# EAGLE design relay power board (EAGLE 6.3)
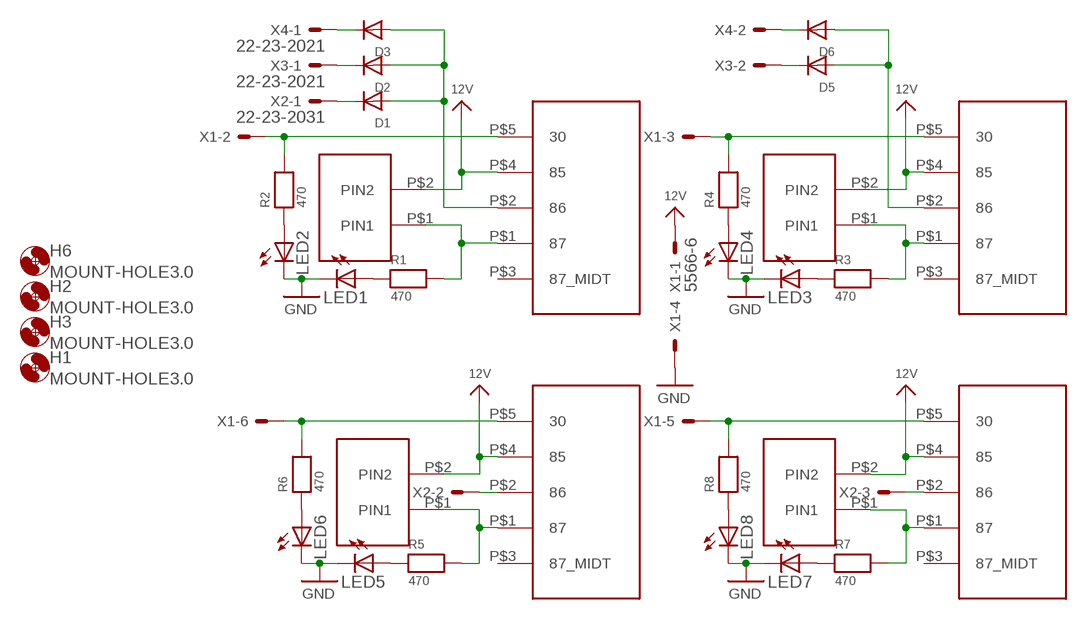
[diagram p0: schematic, sheet 1]

## Parts
D1  DIODESMA  [SMADIODE]
D2  DIODESMA  [SMADIODE]
D3  DIODESMA  [SMADIODE]
D5  DIODESMA  [SMADIODE]
D6  DIODESMA  [SMADIODE]
H1  MOUNT-HOLE3.0  [3,0]
H2  MOUNT-HOLE3.0  [3,0]
H3  MOUNT-HOLE3.0  [3,0]
H6  MOUNT-HOLE3.0  [3,0]
LED1  LEDCHIPLED_1206  [CHIPLED_1206]
LED2  LEDCHIPLED_1206  [CHIPLED_1206]
LED3  LEDCHIPLED_1206  [CHIPLED_1206]
LED4  LEDCHIPLED_1206  [CHIPLED_1206]
LED5  LEDCHIPLED_1206  [CHIPLED_1206]
LED6  LEDCHIPLED_1206  [CHIPLED_1206]
LED7  LEDCHIPLED_1206  [CHIPLED_1206]
LED8  LEDCHIPLED_1206  [CHIPLED_1206]
R1  470  RESISTOR_0603  [_0603]
R2  470  RESISTOR_0603  [_0603]
R3  470  RESISTOR_0603  [_0603]
R4  470  RESISTOR_0603  [_0603]
R5  470  RESISTOR_0603  [_0603]
R6  470  RESISTOR_0603  [_0603]
R7  470  RESISTOR_0603  [_0603]
R8  470  RESISTOR_0603  [_0603]
U$1  FUSE_SOCKET  [FUSE_SOCKET_12V_30A]
U$2  FUSE_SOCKET  [FUSE_SOCKET_12V_30A]
U$3  LITTE_FUSE  [LITTE_FUSE_PAC]
U$4  FUSE_SOCKET  [FUSE_SOCKET_12V_30A]
U$5  LITTE_FUSE  [LITTE_FUSE_PAC]
U$10  FUSE_SOCKET  [FUSE_SOCKET_12V_30A]
U$11  LITTE_FUSE  [LITTE_FUSE_PAC]
U$18  LITTE_FUSE  [LITTE_FUSE_PAC]
X1  5566-6  [5566-6]
X2  22-23-2031  [22-23-2031]
X3  22-23-2021  [22-23-2021]
X4  22-23-2021  [22-23-2021]

## Nets
12V: U$1.P$4 U$2.P$4 U$3.P$2(PIN2) U$4.P$4 U$5.P$2(PIN2) U$10.P$4 U$11.P$2(PIN2) U$18.P$2(PIN2) X1.1
GND: LED1.C LED2.C LED3.C LED4.C LED5.C LED6.C LED7.C LED8.C X1.4
N$1: R3.2 U$2.P$1 U$3.P$1(PIN1)
N$2: R1.2 U$1.P$1 U$5.P$1(PIN1)
N$3: D1.A D2.A D3.A U$1.P$2
N$4: LED1.A R1.1
N$5: LED2.A R2.1
N$6: R2.2 U$1.P$5 X1.2
N$7: D5.A D6.A U$2.P$2
N$8: LED3.A R3.1
N$9: LED4.A R4.1
N$10: R4.2 U$2.P$5 X1.3
N$11: R5.2 U$10.P$1 U$11.P$1(PIN1)
N$12: R7.2 U$4.P$1 U$18.P$1(PIN1)
N$13: LED5.A R5.1
N$14: LED6.A R6.1
N$15: R6.2 U$10.P$5 X1.6
N$16: U$10.P$2 X2.2
N$17: LED7.A R7.1
N$18: LED8.A R8.1
N$19: R8.2 U$4.P$5 X1.5
N$20: U$4.P$2 X2.3
N$21: D1.C X2.1
N$23: D2.C X3.1
N$24: D5.C X3.2
N$25: D3.C X4.1
N$26: D6.C X4.2
Unconnected: U$1.P$3(87_MIDT) U$2.P$3(87_MIDT) U$4.P$3(87_MIDT) U$10.P$3(87_MIDT)

## Library data of the parts
D1-D3 D5 D6 = adafruit:DIODE: Diode SMADIODE - SMA Surface Mount Package 20V 1A Schottky Diode Digikey: 641-1014-6-ND DO-1N4148 - Through Hole Small Current Diode SOD-123 20V 1 A (.5mV Vf) Schottky Diode - Digikey: MBRX120TPMSCT-ND SOD-323 10V 570mA (.38mV Vf, 3ns) Schottky Diode - Digikey: ZLLS410CT-ND SOD-523 30V 30mA Schottky Diode (RB751S-40TE61) - Digikey: RB751S-40TE61CT-ND SOT23-R/W - SOT23 Package (R = Solder Paste/Reflow Ovens, W = Hand-Soldering) BAT54Film 40V 300mA - Digikey: 497-7162-1-ND
H1-H3 H6 = holes:MOUNT-HOLE: MOUNTING HOLE with drill center marker
LED1-LED8 = adafruit:LED: LED OSRAM: - CHIPLED LG R971, LG N971, LY N971, LG Q971, LY Q971, LO R971, LY R971 LH N974, LH R974 LS Q976, LO Q976, LY Q976 LO Q996 - Hyper CHIPLED LW Q18S LB Q993, LB Q99A, LB R99A - SideLED LS A670, LO A670, LY A670, LG A670, LP A670 LB A673, LV A673, LT A673, LW A673 LH A674 LY A675 LS A676, LA A676, LO A676, LY A676, LW A676 LS A679, LY A679, LG A679 - Hyper Micro SIDELED® LS Y876, LA Y876, LO Y876, LY Y876 LT Y87S - SmartLED LW L88C, LW L88S LB L89C, LB L89S, LG L890 LS L89K, LO L89K, LY L89K LS L896, LA L896, LO L896, LY L896 - TOPLED LS T670, LO T670, LY T670, LG T670, LP T670 LSG T670, LSP T670, LSY T670, LOP T670, LYG T670 LG T671, LOG T671, LSG T671 LB T673, LV T673, LT T673, LW T673 LH T674 LS T676, LA T676, LO T676, LY T676, LB T676, LH T676, LSB T676, LW T676 LB T67C, LV T67C, LT T67C, LS T67K, LO T67K, LY T67K, LW E67C LS E67B, LA E67B, LO E67B, LY E67B, LB E67C, LV E67C, LT E67C LW T67C LS T679, LY T679, LG T679 LS T770, LO T770, LY T770, LG T770, LP T770 LB T773, LV T773, LT T773, LW T773 LH T774 LS E675, LA E675, LY E675, LS T675 LS T776, LA T776, LO T776, LY T776, LB T776 LHGB T686 LT T68C, LB T68C - Hyper Mini TOPLED® LB M676 - Mini TOPLED Santana® LG M470 LS M47K, LO M47K, LY M47K Source: http://www.osram.convergy.de/
R1-R8 = microbuilder:RESISTOR: Resistors 0402 - 0402 Surface Mount Package 22 Ohm 1% 1/16W [Digikey: 311-22.0LRTR-ND] 33 Ohm 5% 1/16W 1.0K 5% 1/16W 1.5K 5% 1/16W 2.0K 1% 1/16W 10.0K 1% 1/16W [Digikey: 311-10.0KLRTR-ND] 10.0K 5% 1/16W [Digikey: RMCF0402JT10K0TR-ND] 12.1K 1% 1/16W [Digikey: 311-22.0LRTR-ND] 100.0K 5% 1/16W 0603 - 0603 Surface Mount Package 0 Ohm 1/10 Watt 1% Resistor 15 Ohm 1/10 Watt 1% Resistor 33 Ohm 1/10 Watt 1% Resistor 49.9 Ohm 1/10 Watt 1% Resistor 100 Ohm 1/10 Watt 1% Resistor 150 Ohm 1/10 Watt 1% Resistor 240 Ohm 1/10 Watt 1% Resistor 390 Ohm 1/10 Watt 1% Resistor 560 Ohm 1/10 Watt 1% Resistor 680 Ohm 1/10 Watt 1% Resistor 750 Ohm 1/10 Watt 1% Resistor 1.0K Ohm 1/10 Watt 1% Resistor 1.5K Ohm 1/10 Watt 1% Resistor 2.0K Ohm 1/10 Watt 1% Resistor 2.2K Ohm 1/10 Watt 1% Resistor 3.3K Ohm 1/10 Watt 1% Resistor 4.7K Ohm 1/10 Watt 1% Resistor 10.0K Ohm 1/10 Watt 1% Resistor 12.0K Ohm 1/10 Watt 1% Resistor 12.1K Ohm 1/10 Watt 1% Resistor 20.0K Ohm 1/10 Watt 1% Resistor 33.0K Ohm 1/10 Watt 1% Resistor 100.0K Ohm 1/10 Watt 1% Resistor 0805 - 0805 Surface Mount Package 0 Ohm 1/8 Watt 1% Resistor 33 Ohm 1/8 Watt 1% Resistor 100 Ohm 1/8 Watt 1% Resistor 150 Ohm 1/8 Watt 1% Resistor 200 Ohm 1/8 Watt 1% Resistor 240 Ohm 1/8 Watt 1% Resistor 330 Ohm 1/8 Watt 1% Resistor 390 Ohm 1/8 Watt 1% Resistor 470 Ohm 1/8 Watt 1% Resistor 1.0K Ohm 1/8 Watt 1% Resistor 1.5K Ohm 1/8 Watt 1% Resistor 2.0K Ohm 1/8 Watt 1% Resistor 4.7K Ohm 1/8 Watt 1% Resistor 5.1K Ohm 1/8 Watt 1% Resistor 5.6K Ohm 1/8 Watt 1% Resistor 10.0K Ohm 1/8 Watt 1% Resistor 22.0K Ohm 1/8 Watt 1% Resistor 33.0K Ohm 1/8 Watt 1% Resistor 100K Ohm 1/8 Watt 1% Resistor 1206 - 1206 Surface Mount Package 2012 - 2010 Surface Mount Package 0.11 Ohm 1/2 Watt 1% Resistor - Digikey: RHM.11UCT-ND
U$1 U$2 U$4 U$10 = unicorn_v2:FUSE_SOCKET
U$3 U$5 U$11 U$18 = unicorn_v2:LITTE_FUSE
X1 = con-molex:5566-6: Mini FIT connector 6 pol Source: http://www.molex.com; MPN: 95566-61002; OC_FARNELL: unknown; OC_NEWARK: 22K8620
X2 = con-molex:22-23-2031: .100" (2.54mm) Center Header - 3 Pin; MF: MOLEX; MPN: 22-23-2031; OC_FARNELL: 1462950; OC_NEWARK: 30C0862
X3 X4 = con-molex:22-23-2021: .100" (2.54mm) Center Header - 2 Pin; MF: MOLEX; MPN: 22-23-2021; OC_FARNELL: 1462926; OC_NEWARK: 25C3832

## Board
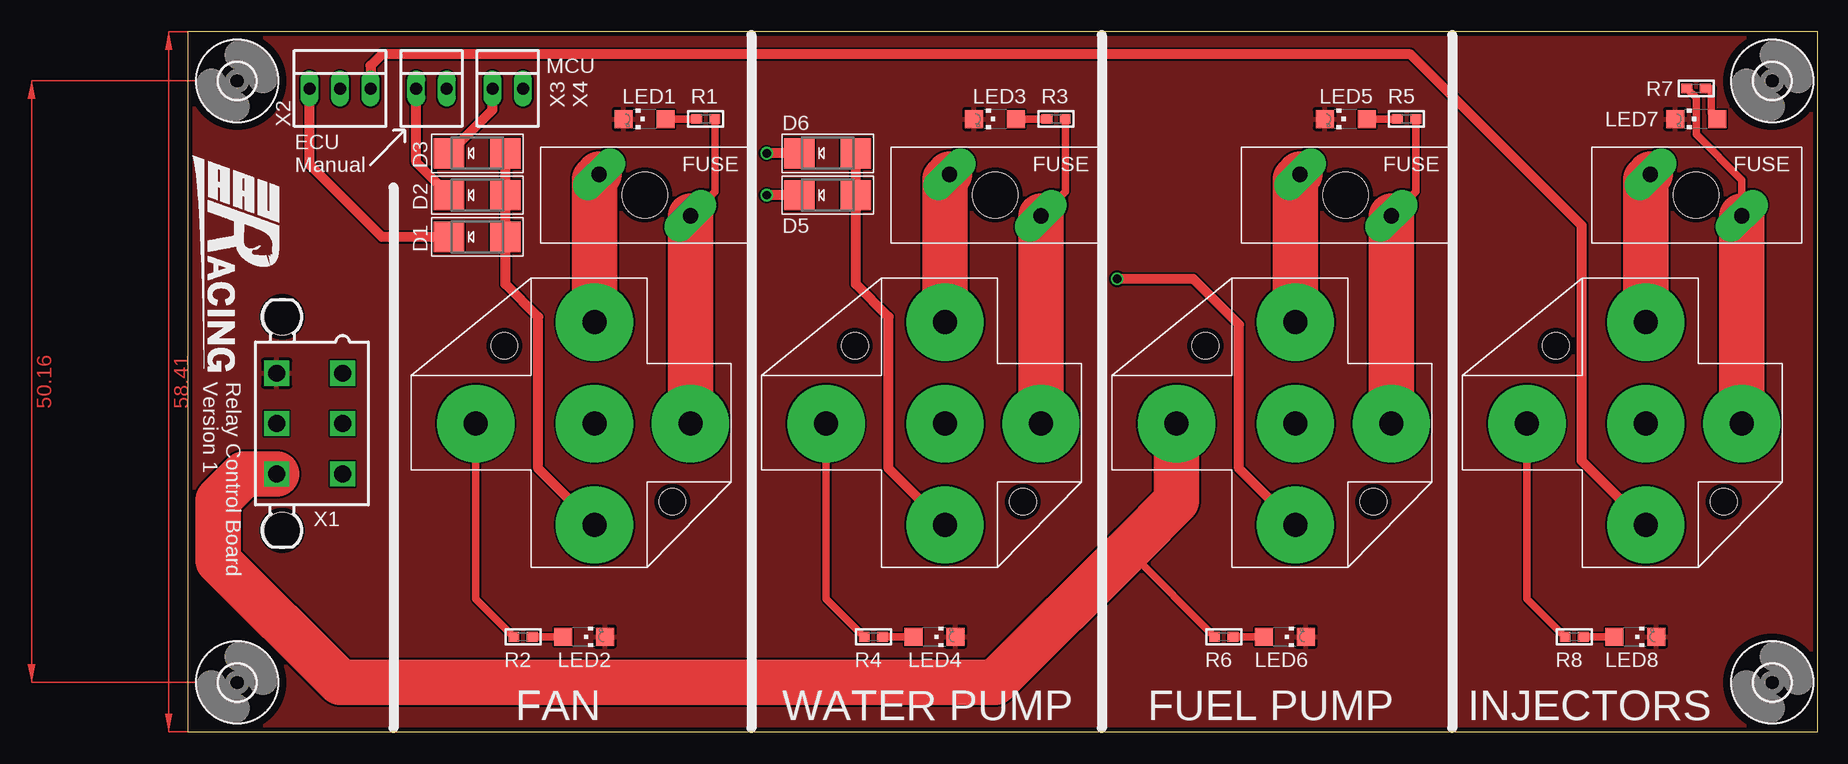
[diagram p1: board, top side]
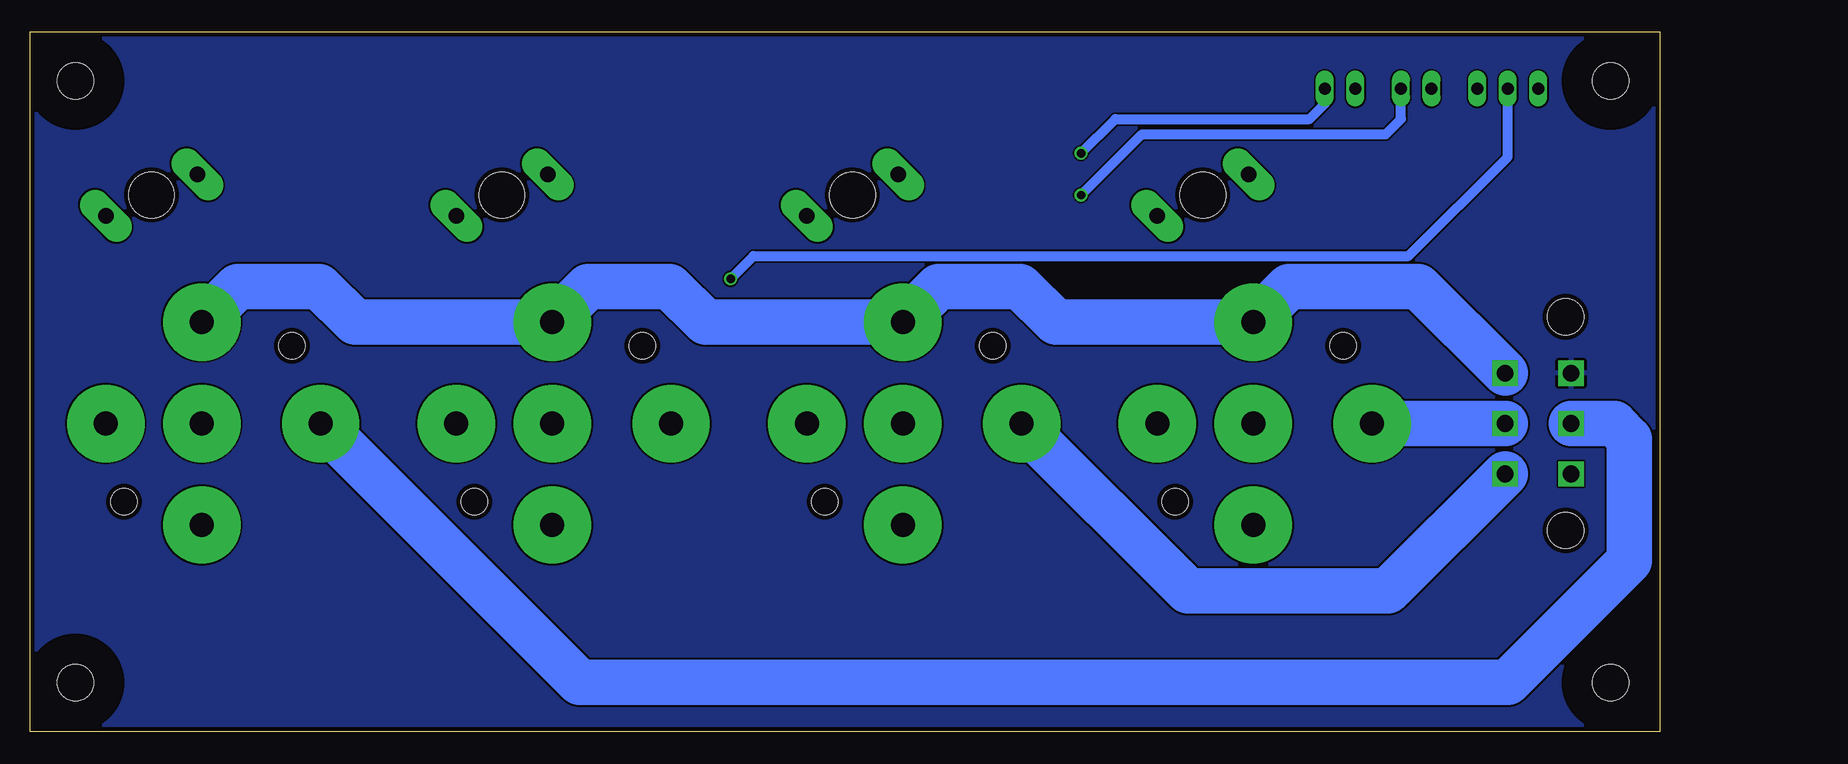
[diagram p2: board, bottom side, seen from below]

Size 135.87 x 58.41 mm. Coordinates in mm from the lower left corner, seen from the top.
Outline: 0,0 135.87,0 135.87,58.41 0,58.41 0,0
Copper layers (1*16): Top 0.0356mm / dielectric 1.5011mm / Bottom 0.0356mm
Design rules "LaenPCBOrder": minimum track width 6mil, minimum drill 13mil, track to track 6mil, track to pad 6mil, pad to pad 6mil, via to via 6mil, smd to smd 6mil, copper to edge 15mil, drill to drill 6mil, minimum pad ring 7mil, minimum via ring 7mil, stop-mask expansion 3mil, vias tented up to drill 0mil, thermal gap 10mil

### Footprints (pad centres in the part's own frame; a part is rotated, then mirrored left to right if it is on the bottom)
SMADIODE = smd 2.54 x 2.54: A 2.349,0; C -2.349,0
3,0 = hole 3: 0,0
CHIPLED_1206 = smd 1.5 x 1.5: A 0,-1.75; C 0,1.75
_0603 = smd 0.9 x 0.8: 1 -0.762,0; 2 0.762,0
FUSE_SOCKET_12V_30A = drill 2 pad 6.452: P$1 0,0; P$2 8,8.45; P$3 8,0; P$4 8,-8.45; P$5 17.9,0 | hole 2.2: 1.5,6.5; 15.5,-6.5
LITTE_FUSE_PAC = drill 1.27 pad 2.54 long: P$1 -1.73,-3.81; P$2 1.73,3.81 | hole 3.78: 0,0
5566-6 = drill 1.4 square: 1 4.2,-2.75; 2 0,-2.75; 3 -4.2,-2.75; 4 4.2,2.75; 5 0,2.75; 6 -4.2,2.75 | hole 3: 8.9,2.29; -8.9,2.29
22-23-2031 = drill 1 long: 1 -2.54,0; 2 0,0; 3 2.54,0
22-23-2021 = drill 1 long: 1 -1.27,0; 2 1.27,0

### Placement (x,y rotation side)
D1  24.13,41.27 0 top
D2  24.13,44.77 0 top
D3  24.13,48.26 0 top
D5  53.34,44.77 0 top
D6  53.34,48.26 0 top
H1  132.08,4.13 0 top
H2  132.08,54.29 0 top
H3  4.13,54.29 0 top
H6  4.13,4.13 0 top
LED1  38.1,51.12 90 top
LED2  33.02,7.94 270 top
LED3  67.31,51.12 90 top
LED4  62.23,7.94 270 top
LED5  96.52,51.12 90 top
LED6  91.44,7.94 270 top
LED7  125.73,51.12 90 top
LED8  120.65,7.94 270 top
R1  43.18,51.12 0 top
R2  27.94,7.94 180 top
R3  72.39,51.12 0 top
R4  57.15,7.94 180 top
R5  101.6,51.12 0 top
R6  86.36,7.94 180 top
R7  125.73,53.66 180 top
R8  115.57,7.94 180 top
U$1  41.91,25.72 180 top
U$2  71.12,25.72 180 top
U$3  67.31,44.77 90 top
U$4  129.54,25.72 180 top
U$5  38.1,44.77 90 top
U$10  100.33,25.72 180 top
U$11  96.52,44.77 90 top
U$18  125.73,44.77 90 top
X1  10.16,25.72 90 top
X2  12.7,53.66 0 top
X3  20.32,53.66 0 top
X4  26.67,53.66 0 top

### Tracks (layer width: path | path; a pad name or v marks a point on that pad's centre or on a via)
12V
  Top 3.81: U$5.P$2 33.91,46.12 U$1.P$4 | U$3.P$2 63.12,46.12 U$2.P$4 | U$11.P$2 92.33,46.12 U$10.P$4 | U$18.P$2 121.54,46.12 U$4.P$4
  Bottom 3.81: X1.1 20.14,37.15 30.93,37.15 U$1.P$4 50.36,34.17 53.34,37.15 60.14,37.15 U$2.P$4 79.57,34.17 82.55,37.15 89.35,37.15 U$10.P$4 108.78,34.17 111.76,37.15 118.56,37.15 U$4.P$4
GND
  pour Top: 0,0 135.89,0 135.89,58.42 0,58.42
  pour Bottom: 0,0 135.89,0 135.89,58.42 0,58.42
N$1
  Top 0.61: U$3.P$1 73.15,45.07 R3.2
  Top 3.81: U$3.P$1 U$2.P$1
N$2
  Top 0.61: U$5.P$1 43.94,45.07 R1.2
  Top 3.81: U$1.P$1 U$5.P$1
N$3
  Top 0.813: U$1.P$2 29.21,21.97 29.21,34.61 26.48,37.34 D1.A D2.A D3.A
N$4
  Top 0.61: R1.1 LED1.A
N$5
  Top 0.61: R2.1 LED2.A
N$6
  Top 0.61: U$1.P$5 24.01,11.11 R2.2
  Bottom 3.81: U$1.P$5 X1.2
N$7
  Top 0.813: U$2.P$2 58.42,21.97 58.42,34.61 55.69,37.34 D5.A D6.A
N$8
  Top 0.61: R3.1 LED3.A
N$9
  Top 0.61: R4.1 LED4.A
N$10
  Top 0.61: U$2.P$5 53.22,11.11 R4.2
  Bottom 3.81: X1.3 22.68,11.75 39.37,11.75 53.22,25.6 U$2.P$5
N$11
  Top 0.61: U$11.P$1 102.36,45.07 R5.2
  Top 3.81: U$11.P$1 U$10.P$1
N$12
  Top 0.61: R7.2 125.73,52.9 125.73,49.85 129.54,46.04 U$18.P$1
  Top 3.81: U$18.P$1 U$4.P$1
N$13
  Top 0.61: R5.1 LED5.A
N$14
  Top 0.61: R6.1 LED6.A
N$15
  Top 0.61: R6.2 78.74,14.8 78.74,15.56
  Top 3.81: U$10.P$5 82.43,19.25 78.74,15.56 67.31,4.13 12.7,4.13 2.54,14.29 2.54,19.37 4.69,21.52 X1.6
N$16  (via drill 0.7)
  Top 0.813: U$10.P$2 87.63,21.97 87.63,33.97 83.82,37.78 v77.47,37.78
  Bottom 0.813: v77.47,37.78 75.56,39.69 20.95,39.69 12.7,47.94 X2.2
N$17
  Top 0.61: LED7.A 127,51.6 127,53.66 R7.1
N$18
  Top 0.61: R8.1 LED8.A
N$19
  Top 0.61: U$4.P$5 111.64,11.11 R8.2
  Bottom 3.81: U$4.P$5 90.05,4.13 12.7,4.13 2.54,14.29 2.54,24.45 3.81,25.72 X1.5
N$20
  Top 0.813: U$4.P$2 116.2,22.6 116.2,42.23 101.92,56.52 16.19,56.52 15.24,55.56 X2.3
N$21
  Top 0.813: D1.C 16.19,41.27 10.16,47.31 X2.1
N$23
  Top 0.813: D2.C 19.05,47.5 X3.1
N$24  (via drill 0.7)
  Top 0.813: D5.C v48.26,44.77
  Bottom 0.813: v48.26,44.77 43.18,49.85 22.86,49.85 21.59,51.12 X3.2
N$25
  Top 0.813: D3.C 25.4,51.88 X4.1
N$26  (via drill 0.7)
  Top 0.813: D6.C v48.26,48.26
  Bottom 0.813: v48.26,48.26 45.4,51.12 29.21,51.12 27.94,52.39 X4.2
(copper drawn outside any net)
  shapes: Top area x2

### Text on the board
tSilk: MCU | ECU | Manual | Relay Control Board / Version 1 | FAN | WATER PUMP | FUEL PUMP | INJECTORS